# EasyEDA Pro project PCB1.epro

# Board PCB1
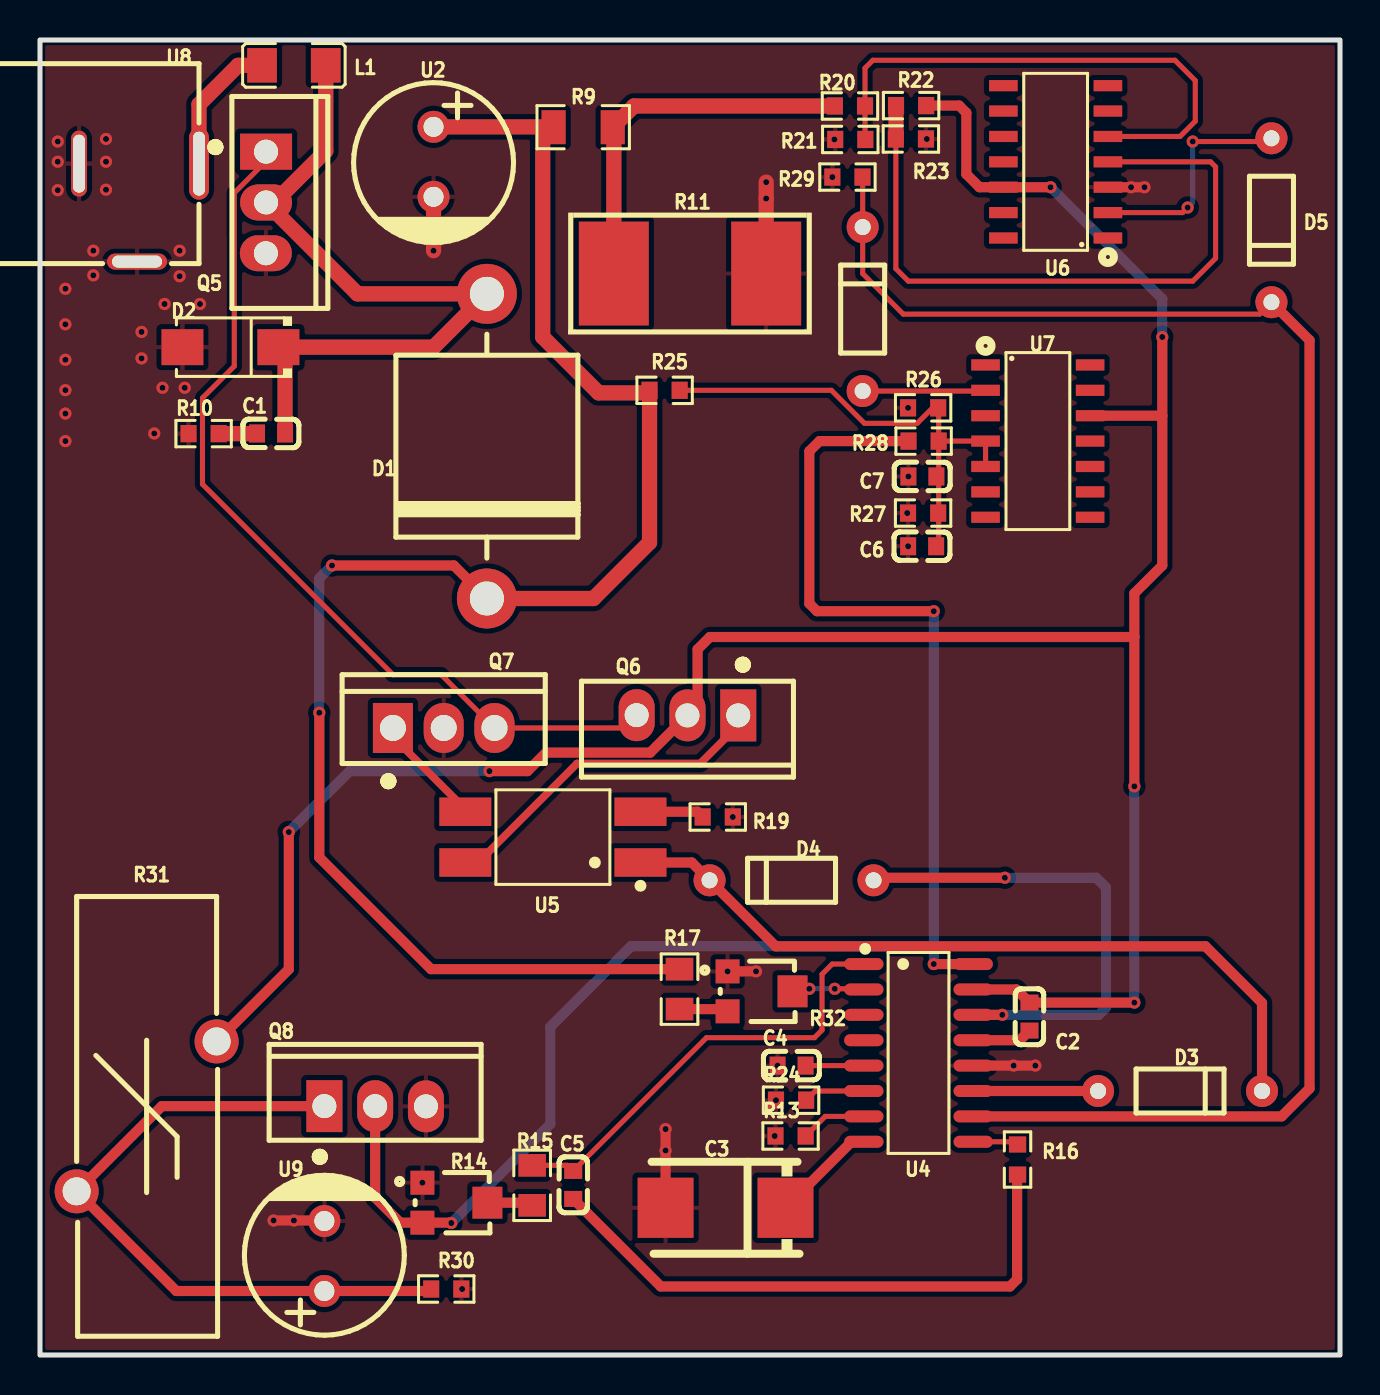
[diagram p0: board, top side]
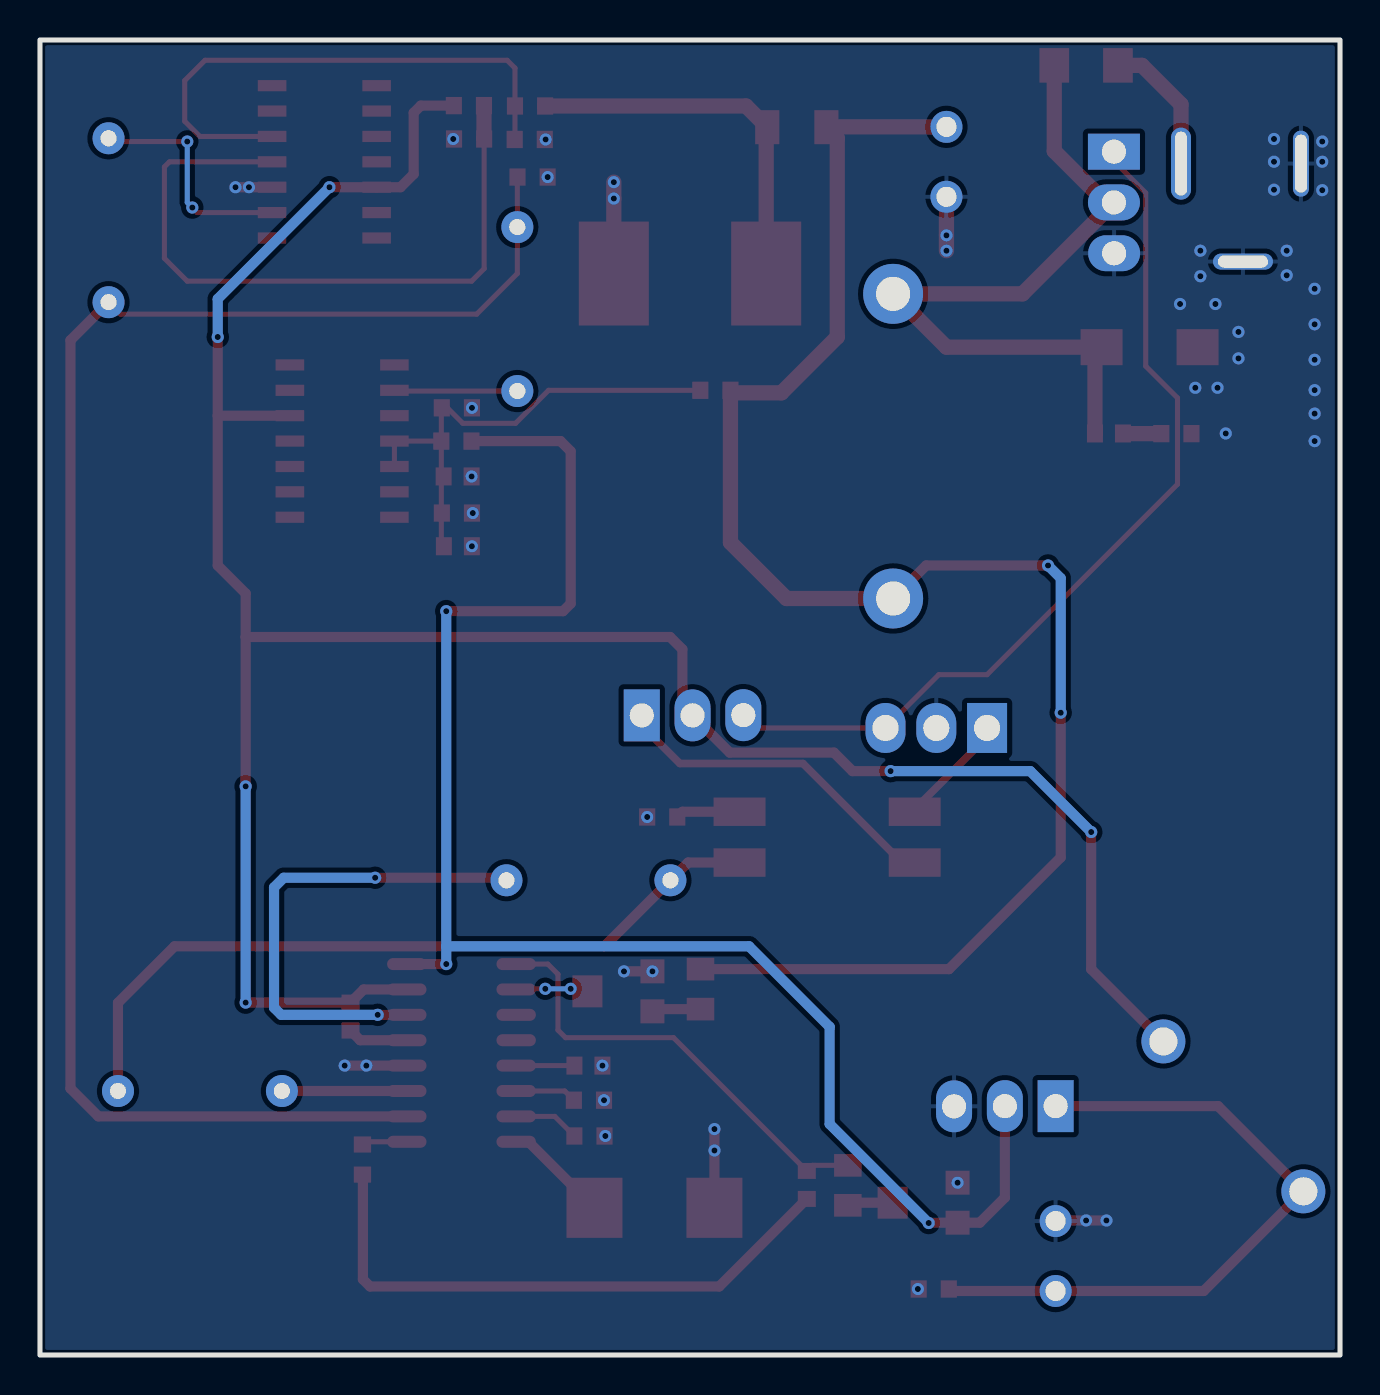
[diagram p1: board, bottom side, seen from below]

Outline 65.02 x 65.79 mm; copper layers: Top Layer, Bottom Layer. Coordinates in mm from the lower left corner of the outline.
Outline path: rectangle 0,65.79 65.02,0
Stack: Top Layer 0.035mm / Dielectric1 1.51mm FR4 er 4.5 / Bottom Layer 0.035mm

## Design rules (mm)
template: JLCPCB Capability(Two Layers Board)
spacing copperThickness1oz (default): track to track 0.102, other pairs 0.152 to 0.3
spacing copperThickness2oz: track to track 0.203, other pairs 0.152 to 0.3
track width copperThickness1oz (default): min 0.127, default 0.254, max 2.54
track width copperThickness2oz: min 0.203, default 0.254, max 2.54
differential pair differentialPair (default): width min 0.127, default 0.254, max 2.54; gap min 0.152, default 0.152
via viaSize (default): diameter min 0.5, default 0.61, max 10; hole min 0.3, default 0.305, max 6.3

## Placement (name value [footprint] x y rotation side)
C1  75pF  [C0603]  11.56 46.1 0 top
C2  100nF  [C0603]  49.49 16.93 90 top
C3  100uF  [CASE-D_7343]  34.29 7.37 0 top
C4  1nF  [C0603]  37.59 14.48 0 top
C5  1nF  [C0603]  26.67 8.51 270 top
C6  20nF  [C0603]  44.12 40.46 0 top
C7  20nF  [C0603]  44.14 43.95 0 top
D1  P600D  [R-6_BD9.0-L9.0-P13.00-D1.6-RD]  22.35 45.47 90 top
D2  SS56  [SMA_L4.3-W2.7-LS5.1-RD]  9.52 50.42 180 top
D3  1N4148  [DO-35_BD2.0-L4.2-P8.20-D0.5-RD]  57.02 13.21 180 top
D4  1N4148  [DO-35_BD2.0-L4.2-P8.20-D0.5-RD]  37.59 23.75 0 top
D5  1N4148  [DO-35_BD2.0-L4.2-P8.20-D0.5-RD]  61.59 56.77 90 top
D6  1N4148  [DO-35_BD2.0-L4.2-P8.20-D0.5-RD]  41.15 52.32 270 top
L1  12uH  [L1206]  12.7 64.52 0 top
Q5  IRF640NPBF  [TO-220-3_L10.0-W4.5-P2.54-L]  11.3 57.66 270 top
Q6  D44H8  [TO-220-3_L10.0-W4.5-P2.54-L]  32.39 32 180 top
Q7  D45H8G  [TO-220-3_L10.0-W4.5-P2.54-T]  20.19 31.37 90 top
Q8  D44H8  [TO-220-3_L10.0-W4.5-P2.54-L]  16.76 12.45 0 top
R9  24Ω  [R1206]  27.17 61.42 180 top
R10  510Ω  [R0603]  8.18 46.09 0 top
R11  0.2mΩ  [R3920]  32.51 54.1 180 top
R13  200Ω  [R0603]  37.54 10.96 0 top
R14  10kΩ  [RES-ADJ-SMD_3P-L3.0-W3.8-P1.75-BR]  20.75 7.62 180 top
R15  10kΩ  [R0805]  24.62 8.49 90 top
R16  200Ω  [R0603]  48.89 9.78 90 top
R17  35kΩ  [R0805]  31.99 18.3 90 top
R19  200Ω  [R0603]  33.9 26.92 180 top
R20  1kΩ  [R0603]  40.51 62.48 180 top
R21  5kΩ  [R0603]  40.53 60.81 0 top
R22  51kΩ  [R0603]  43.57 62.5 0 top
R23  3.5kΩ  [R0603]  43.56 60.83 180 top
R24  6.2kΩ  [R0603]  37.57 12.75 0 top
R25  115kΩ  [R0603]  31.24 48.26 180 top
R26  5kΩ  [R0603]  44.17 47.38 0 top
R27  3kΩ  [R0603]  44.17 42.12 0 top
R28  2kΩ  [R0603]  44.2 45.72 180 top
R29  10kΩ  [R0603]  40.39 58.93 0 top
R30  250Ω  [R0603]  20.32 3.3 0 top
R31  4.9kΩ  [RES-TH_L22.0-W7.0-P7.50-D1.0-S1.00]  5.33 11.94 90 top
R32  2kΩ  [RES-ADJ-SMD_3P-L3.0-W3.8-P1.75-BR]  36.02 18.19 180 top
U2  27uF  [CAP-TH_BD8.0-P3.50-D0.5-FD]  19.68 59.69 270 top
U4  SG3525AP013TR  [SOIC-16_L9.9-W3.9-P1.27-LS6.0-BL]  43.94 15.11 270 top
U5  TLP521  [SOP-4_L6.4-W4.6-P2.54-LS10.2-TL]  25.65 25.91 180 top
U6  LM339  [SOP-14_L8.7-W3.9-P1.27-LS6.0-BL]  50.8 59.69 90 top
U7  LM339  [SOP-14_L8.7-W3.9-P1.27-LS6.0-BL]  49.91 45.72 270 top
U8  DC-S006A-D020-5A  [CONN-TH_DC-S006A-D020-5A]  4.95 57.15 0 top
U9  10uF  [CAP-TH_BD8.0-P3.50-D0.5-FD]  14.22 4.95 90 top

## Footprints (pads in the part's own frame, mm; a bottom-side part is the same pattern mirrored in y, then rotated)
C0603
  rect 0.8x0.9 smd: 1(-0.7,0) 2(0.7,0)
CAP-TH_BD8.0-P3.50-D0.5-FD
  round 1.6 hole 1: 1(-1.75,0) 2(1.75,0)
CASE-D_7343
  rect 2.799x3.01 smd: 1(3,0) 2(-3,0)
CONN-TH_DC-S006A-D020-5A
  oval 1x3.6 hole 0.6x3.2: 1(3,2.45)
  oval 0.8x3.3 hole 0.6x2.9: 2(-3,2.45)
  oval 3x0.8 hole 2.5x0.6: 3(-0.1,-2.45)
DO-35_BD2.0-L4.2-P8.20-D0.5-RD
  round 1.6 hole 0.8: 1(-4.1,0) 2(4.1,0)
L1206
  rect 1.485x1.728 smd: 1(-1.593,0) 2(1.593,0)
R0603
  rect 0.806x0.864 smd: 1(-0.753,0) 2(0.753,0)
R0805
  rect 1.133x1.377 smd: 1(-1,0) 2(1,0)
R1206
  rect 1.208x1.701 smd: 1(-1.479,0) 2(1.479,0)
R3920
  rect 3.5x5.2 smd: 1(-3.81,0) 2(3.81,0)
R-6_BD9.0-L9.0-P13.00-D1.6-RD
  round 3 hole 1.7: 1(-7.62,0) 2(7.62,0)
RES-ADJ-SMD_3P-L3.0-W3.8-P1.75-BR
  rect 1.2x1.2 smd: 1(1.625,-1) 3(1.625,1)
  rect 1.5x1.6 smd: 2(-1.625,0)
RES-TH_L22.0-W7.0-P7.50-D1.0-S1.00
  round 2.2 hole 1.4: 1(-3.75,3.5) 2(3.75,-3.5)
SMA_L4.3-W2.7-LS5.1-RD
  rect 2.1x1.8 smd: 1(-2.4,0) 2(2.4,0)
SOIC-16_L9.9-W3.9-P1.27-LS6.0-BL
  oval 0.602x1.971 smd: 1(-4.445,-2.736) 2(-3.175,-2.736) 3(-1.905,-2.736) 4(-0.635,-2.736) 5(0.635,-2.736) 6(1.905,-2.736) 7(3.175,-2.736) 8(4.445,-2.736) 9(4.445,2.736) 10(3.175,2.736) 11(1.905,2.736) 12(0.635,2.736) 13(-0.635,2.736) 14(-1.905,2.736) 15(-3.175,2.736) 16(-4.445,2.736)
SOP-4_L6.4-W4.6-P2.54-LS10.2-TL
  rect 2.6x1.423 smd: 1(-4.38,1.27) 2(-4.38,-1.27) 3(4.38,-1.27) 4(4.38,1.27)
SOP-14_L8.7-W3.9-P1.27-LS6.0-BL
  rect 0.56x1.43 smd: 1(-3.81,-2.615) 2(-2.54,-2.615) 3(-1.27,-2.615) 4(0,-2.615) 5(1.27,-2.615) 6(2.54,-2.615) 7(3.81,-2.615) 8(3.81,2.615) 9(2.54,2.615) 10(1.27,2.615) 11(0,2.615) 12(-1.27,2.615) 13(-2.54,2.615) 14(-3.81,2.615)
TO-220-3_L10.0-W4.5-P2.54-L
  rect 1.8x2.6 hole 1.2: 1(-2.54,0.005)
  oval 1.8x2.6 hole 1.2: 2(0,0.005) 3(2.54,-0.005)
TO-220-3_L10.0-W4.5-P2.54-T
  rect 2.5x2 hole 1.3: 1(0,2.54)
  oval 2.5x2 hole 1.3: 2(0,0) 3(0,-2.54)

## Nets
5.1V: Q8.2 R14.3 R28.2 U4.16
15V: C2.2 Q6.2 R22.2 R31.2 U4.15 U6.12 U7.12
-15V: U7.3
GND: C3.2 C4.1 C6.1 C7.1 D2.2 Q5.3 Q7.2 Q8.3 R10.1 R11.1 R13.1 R14.1 R19.1 R21.1 R23.1 R24.1 R26.1 R27.1 R29.1 R30.2 R32.1 U2.2 U4.12 U6.3 U8.2 U8.3 U9.2
PA6: Q5.1 Q6.3 Q7.3
$1N2607: C1.2 D1.2 D2.1 L1.2 Q5.2
$1N7301: C1.1 R10.2
$1N7444: R9.1 R11.2 R20.2
$1N7581: C2.1 U4.13
$1N7749: C3.1 U4.8
$1N7995: C4.2 U4.5
$1N8190: R13.2 U4.7
$1N8382: D4.2 U4.14
$1N8428: D3.2 U4.11
$1N8442: D3.1 D4.1 U5.1
$1N9410: R14.2 R15.1
$1N9486: R16.2 U4.9
$1N9572: C5.2 R16.1
$1N10012: C5.1 R15.2 U4.1
$1N10867: R19.2 U5.2
$1N11240: Q6.1 U5.4
$1N11251: Q7.1 U5.3
$1N11333: D5.1 D6.1 R29.2 U4.10
$1N11587: D5.2 U6.2
$1N11747: R20.1 R21.2 U6.5
$1N11928: R22.1 R23.2 U6.4
$1N12117: R24.2 U4.6
$1N12809: C6.2 C7.2 R25.1 R26.2 R27.2 R28.1 U7.4 U7.5
$1N12900: D1.1 R9.2 R17.2 R25.2 U2.1
$1N13190: D6.2 U7.2
$1N13628: L1.1 U8.1
$1N15056: Q8.1 R30.1 R31.1 U9.1
$1N16620: R32.2 U4.2
$1N16679: R17.1 R32.3

Pads without a net: U4 3 4; U6 1 6 7 8 9 10 11 13 14; U7 1 6 7 8 9 10 11 13 14

## Via types
v1: diameter 0.61, hole 0.305, Top Layer to Bottom Layer, 67 vias

## Routing (per net, layer and track width the routed paths; a pad name or vN(x,y) marks a point on that pad's centre or on a via; arc(x,y) is an arc through that point)
5.1V: length 80.4
  Top Layer w0.508: v1(20.57,6.6) 20.56,6.62 R14.3 18.02,6.62 16.76,7.87 Q8.2 ; v1(44.7,19.56) 46.68,19.56 ; R28.2 38.99,45.72 38.48,45.21 38.48,37.59 38.86,37.21 v1(44.7,37.21)
  Bottom Layer w0.508: v1(44.7,37.21) 44.7,20.45 ; 44.7,20.45 29.56,20.45 25.53,16.42 25.53,11.56 v1(20.57,6.6) ; 44.7,20.45 v1(44.7,19.56)
15V: length 125.3
  Top Layer w0.508: U7.12 56.13,46.99 ; 56.13,46.99 56.13,39.5 54.74,38.1 54.74,35.92 ; 56.13,46.99 v1(56.13,50.93) ; v1(54.74,28.45) 54.74,35.92 ; 54.74,35.92 33.51,35.92 32.89,35.31 32.89,32.51 Q6.2 30.52,30.14 25.31,30.14 24.38,29.21 v1(22.48,29.21) ; 8.83,15.69 12.45,19.3 v1(12.45,26.16) ; v1(54.74,17.63) C2.2 48.83,18.29 U4.15 ; R22.2 45.97,62.5 46.33,62.14 46.33,59.08 46.99,58.42 U6.12 v1(50.55,58.42)
  Bottom Layer w0.508: v1(12.45,26.16) 15.49,29.21 v1(22.48,29.21) ; v1(50.55,58.42) 56.13,52.83 v1(56.13,50.93) ; v1(54.74,17.63) v1(54.74,28.45)
GND: length 20.1
  Top Layer w0.508: C3.2 v1(31.29,10.23) v1(31.29,11.3) ; U4.12 v1(48.7,14.48) v1(49.78,14.48) ; v1(55.24,58.42) v1(54.57,58.42) U6.3 ; v1(11.68,6.73) v1(12.7,6.73) 14.2,6.73 U9.2 ; v1(34.39,19.19) v1(35.81,19.19)
  Top Layer w0.762: U2.2 v1(19.68,56.01) v1(19.68,55.25) ; R11.1 v1(36.32,57.85) v1(36.32,58.67)
  vias: v1(0.89,60.71) v1(0.89,59.69) v1(0.89,58.27) v1(1.27,53.34) v1(1.27,51.56) v1(1.27,49.79) v1(1.27,48.27) v1(1.27,47.1) v1(1.27,45.72) v1(2.67,55.25) v1(2.67,54.01) v1(3.3,60.83) v1(3.3,59.69) v1(3.3,58.3) v1(5.08,51.18) v1(5.08,49.86) v1(5.72,46.1) v1(6.13,48.39) v1(6.23,52.58) v1(6.98,55.25) v1(6.98,53.97) v1(7.24,48.39) v1(8,52.58) v1(19.13,8.62) v1(21.11,3.3) v1(34.65,26.92) v1(36.75,10.96) v1(36.89,14.48) v1(36.81,12.75) v1(39.63,58.93) v1(39.73,60.81) v1(43.38,42.12) v1(43.42,47.38) v1(43.43,43.95) v1(43.42,40.46) v1(44.36,60.83)
PA6: length 45
  Top Layer w0.254: Q6.3 29.2,31.37 Q7.3 20.07,34.04 17.65,34.04 8.13,43.56 8.13,47.88 9.72,49.47 9.72,58.14 11.31,59.73 Q5.1
$1N2607: length 36.9
  Top Layer w0.762: C1.2 12.26,50.31 12.15,50.42 19.68,50.42 D1.2 15.88,53.09 Q5.2 11.72,57.66 14.29,60.23 L1.2
$1N7301: length 1.9
  Top Layer w0.762: R10.2 10.85,46.09 C1.1
$1N7444: length 18.9
  Top Layer w0.762: R20.2 29.71,62.48 28.65,61.42 28.7,61.37 R11.2
$1N7581: length 3
  Top Layer w0.508: U4.13 49.01,15.75 C2.1
$1N7749: length 5.3
  Top Layer w0.508: C3.1 40.59,10.67 U4.8
$1N7995: length 2.9
  Top Layer w0.254: U4.5 C4.2
$1N8190: length 3.3
  Top Layer w0.254: U4.7 39.28,11.94 R13.2
$1N8382: length 24.7
  Top Layer w0.508: U4.14 v1(48.13,17.02) ; D4.2 41.82,23.88 v1(48.26,23.88)
  Bottom Layer w0.508: v1(48.26,23.88) 52.83,23.88 53.32,23.39 53.32,17.38 52.96,17.02 v1(48.13,17.02)
$1N8428: length 6.2
  Top Layer w0.508: U4.11 D3.2
$1N8442: length 38.4
  Top Layer w0.508: D3.1 61.12,17.62 58.29,20.45 36.79,20.45 D4.1 32.6,24.64 U5.1
$1N9410: length 2.3
  Top Layer w0.508: R14.2 24.48,7.62 R15.1
$1N9486: length 2.3
  Top Layer w0.254: R16.2 48.76,10.67 U4.9
$1N9572: length 29.4
  Top Layer w0.508: C5.2 31.05,3.43 48.51,3.43 48.87,3.79 48.87,9 R16.1
$1N10012: length 22.6
  Top Layer w0.254: R15.2 26.39,9.49 C5.1 33.34,15.88 38.73,15.88 39.12,16.26 39.12,19.05 39.62,19.56 41.21,19.56
$1N10867: length 3.2
  Top Layer w0.508: U5.2 32.88,27.18 R19.2
$1N11240: length 16.7
  Top Layer w0.381: 21.65,24.38 26.86,29.59 33.02,29.59 34.92,31.5 Q6.1
$1N11251: length 6.1
  Top Layer w0.381: Q7.1 17.65,30.93 21.65,26.92
$1N11333: length 83.9
  Top Layer w0.254: D5.1 61,52.07 43.18,52.07 41.15,54.1 D6.1 41.15,58.92 R29.2
  Top Layer w0.508: D5.1 63.5,50.76 63.5,13.34 62.1,11.94 U4.10
$1N11587: length 11.5
  Top Layer w0.254: 53.42,57.15 57.15,57.15 v1(57.4,57.4) ; v1(57.66,60.71) 61.43,60.71 D5.2
  Bottom Layer w0.254: v1(57.4,57.4) 57.66,57.66 v1(57.66,60.71)
$1N11747: length 27.4
  Top Layer w0.254: R21.2 41.27,60.83 R20.1 41.27,64.38 41.66,64.77 56.77,64.77 57.79,63.75 57.79,61.72 57.02,60.96 U6.5
$1N11928: length 34.9
  Top Layer w0.254: U6.4 58.55,59.69 58.8,59.44 58.8,54.86 57.66,53.72 43.43,53.72 42.81,54.35 R23.2
  Top Layer w0.762: R23.2 42.82,60.84 R22.1
$1N12117: length 3.1
  Top Layer w0.254: U4.6 38.78,13.21 R24.2
$1N12809: length 24.5
  Top Layer w0.254: U7.5 U7.4 R28.1 ; R28.1 44.95,40.46 ; R28.1 44.95,47.36 ; 44.95,47.36 44.62,47.36 43.87,46.61 41.24,46.61 39.59,48.26 R25.1 ; 44.95,47.36 R26.2
$1N12900: length 83.8
  Top Layer w0.508: R17.2 19.56,19.3 13.97,24.89 v1(13.97,32.13) ; v1(14.61,39.5) 20.7,39.5 D1.1
  Top Layer w0.762: U2.1 25.67,61.44 R9.2 25.15,60.88 25.15,50.93 27.94,48.13 30.36,48.13 R25.2 30.49,40.65 27.69,37.85 D1.1
  Bottom Layer w0.508: v1(13.97,32.13) 13.97,38.86 v1(14.61,39.5)
$1N13190: length 6.2
  Top Layer w0.254: D6.2 47.26,48.22 U7.2
$1N13628: length 6.9
  Top Layer w0.762: L1.1 9.91,64.52 7.95,62.56 U8.1
$1N15056: length 34
  Top Layer w0.508: Q8.1 6.1,12.45 R31.1 6.82,3.2 U9.1 19.47,3.2 R30.1
$1N16620: length 3.6
  Top Layer w0.254: v1(39.75,18.32) 41.17,18.32 U4.2 ; v1(38.48,18.32) 37.64,18.32
  Bottom Layer w0.254: v1(38.48,18.32) v1(39.75,18.32)
$1N16679: length 2.4
  Top Layer w0.508: R17.1 34.28,17.3 R32.3

## Copper pours and planes (outline as drawn; the poured copper is in the pictures)
GND on Top Layer: -13.97,70.87 87.5,70.87 87.5,-17.02 -13.97,-17.02
GND on Top Layer: 0.51,62.48 0.51,45.47 1.4,44.58 7.49,44.58 7.81,44.9 7.81,48.69 8.53,49.4 8.64,49.4 12.83,53.59 12.83,55.5 12.32,56.01 3.81,56.01 3.81,62.48
GND on Top Layer: 38.48,61.59 40.39,61.59 40.39,57.55 38.48,57.55
GND on Bottom Layer: -15.11,75.56 77.22,75.56 77.22,-11.3 -15.11,-11.3
